# EAGLE design v1.0 (EAGLE 5.11)
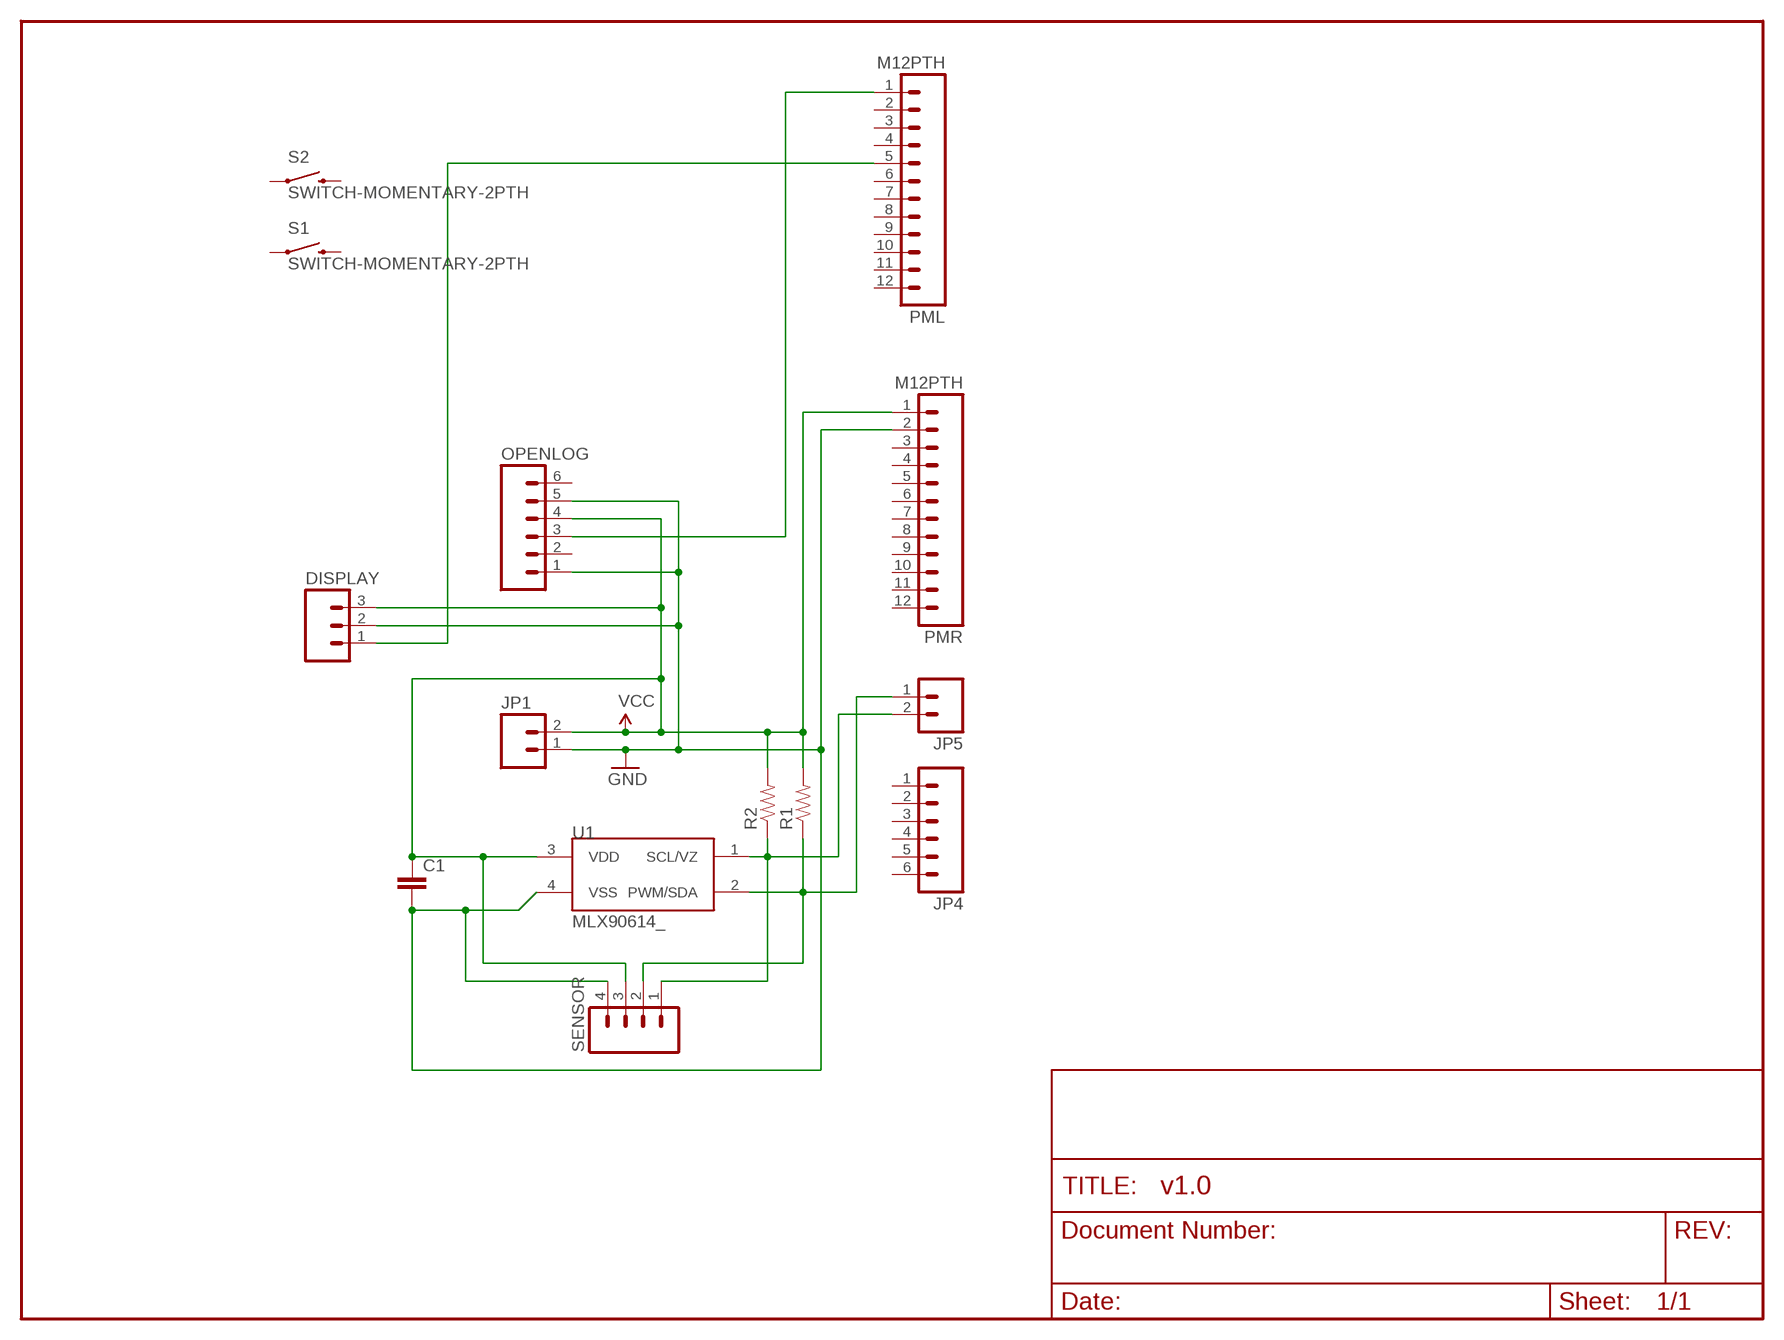
[diagram p0: schematic, sheet 1]

## Parts
C1  CAPPTH3  [CAP-PTH-LARGE]
DISPLAY  M03SCREW_LOCK  [SCREWTERMINAL-3.5MM-3_LOCK.007S]
JP1  M02JST-PTH-2  [JST-2-PTH]
JP4  M06SIP  [1X06]
JP5  M02PTH  [1X02]
OPENLOG  M06LOCK  [1X06_LOCK]
PML  M12PTH  [1X12]
PMR  M12PTH  [1X12]
R1  RESISTORPTH-1/4W  [AXIAL-0.4]
R2  RESISTORPTH-1/4W  [AXIAL-0.4]
S1  SWITCH-MOMENTARY-2PTH  [TACTILE-PTH]
S2  SWITCH-MOMENTARY-2PTH  [TACTILE-PTH]
SENSOR  M04SCREW_LOCK  [SCREWTERMINAL-3.5MM-4_LOCK]
U1  MLX90614_  [TO-39]

## Nets
GND: C1.2 DISPLAY.2 JP1.1 OPENLOG.1 OPENLOG.5 PMR.2 SENSOR.4 U1.4(VSS)
N$1: JP5.2 R2.P$1 SENSOR.1 U1.1(SCL/VZ)
N$2: JP5.1 R1.P$1 SENSOR.2 U1.2(PWM/SDA)
N$4: DISPLAY.1 PML.5
N$6: OPENLOG.3 PML.1
VCC: C1.1 DISPLAY.3 JP1.2 OPENLOG.4 PMR.1 R1.P$2 R2.P$2 SENSOR.3 U1.3(VDD)
Unconnected: JP4.1 JP4.2 JP4.3 JP4.4 JP4.5 JP4.6 OPENLOG.2 OPENLOG.6 PML.2 PML.3 PML.4 PML.6 PML.7 PML.8 PML.9 PML.10 PML.11 PML.12 PMR.3 PMR.4 PMR.5 PMR.6 PMR.7 PMR.8 PMR.9 PMR.10 PMR.11 PMR.12 S1.1 S1.3 S2.1 S2.3

## Library data of the parts
C1 = SparkFun:CAP: Capacitor Standard 0603 ceramic capacitor, and 0.1" leaded capacitor.
DISPLAY = SparkFun:M03: Header 3 Standard 3-pin 0.1" header. Use with straight break away headers (SKU : PRT-00116), right angle break away headers (PRT-00553), swiss pins (PRT-00743), machine pins (PRT-00117), and female headers (PRT-00115). Molex polarized connector foot print use with SKU : PRT-08232 with associated crimp pins and housings.
JP1 JP5 = SparkFun:M02: Header 2 Standard 2-pin 0.1" header. Use with straight break away headers (SKU : PRT-00116), right angle break away headers (PRT-00553), swiss pins (PRT-00743), machine pins (PRT-00117), and female headers (PRT-00115). Molex polarized connector foot print use with SKU : PRT-08233 with associated crimp pins and housings.
JP4 OPENLOG = SparkFun:M06: Header 6 Standard 6-pin 0.1" header. Use with straight break away headers (SKU : PRT-00116), right angle break away headers (PRT-00553), swiss pins (PRT-00743), machine pins (PRT-00117), and female headers (PRT-00115). Molex polarized connector foot print use with SKU : PRT-08094 with associated crimp pins and housings. NOTES ON THE VARIANTS LOCK and LOCK_LONGPADS... This footprint was designed to help hold the alignment of a through-hole component (i.e. 6-pin header) while soldering it into place. You may notice that each hole has been shifted either up or down by 0.005 of an inch from it's more standard position (which is a perfectly straight line). This slight alteration caused the pins (the squares in the middle) to touch the edges of the holes. Because they are alternating, it causes a "brace" to hold the component in place. 0.005 has proven to be the perfect amount of "off-center" position when using our standard breakaway headers. Although looks a little odd when you look at the bare footprint, once you have a header in there, the alteration is very hard to notice. Also, if you push a header all the way into place, it is covered up entirely on the bottom side. This idea of altering the position of holes to aid alignment will be further integrated into the Sparkfun Library for other footprints. It can help hold any component with 3 or more connection pins.
PML PMR = SparkFun:M12: Header 12 Standard 12-pin 0.1" header. Use with straight break away headers (SKU : PRT-00116), right angle break away headers (PRT-00553), swiss pins (PRT-00743), machine pins (PRT-00117), and female headers (PRT-00115).
R1 R2 = SparkFun:RESISTOR: Resistor Basic schematic elements and footprints for 0603, 1206, and PTH resistors.
S1 S2 = SparkFun:SWITCH-MOMENTARY-2
SENSOR = SparkFun:M04: Header 4 Standard 4-pin 0.1" header. Use with straight break away headers (SKU : PRT-00116), right angle break away headers (PRT-00553), swiss pins (PRT-00743), machine pins (PRT-00117), and female headers (PRT-00115). Molex polarized connector foot print use with SKU : PRT-08231 with associated crimp pins and housings. 1MM SMD Version SKU: PRT-10208
U1 = SparkFun:MLX90614: Melexis IR Thermometer

## Board
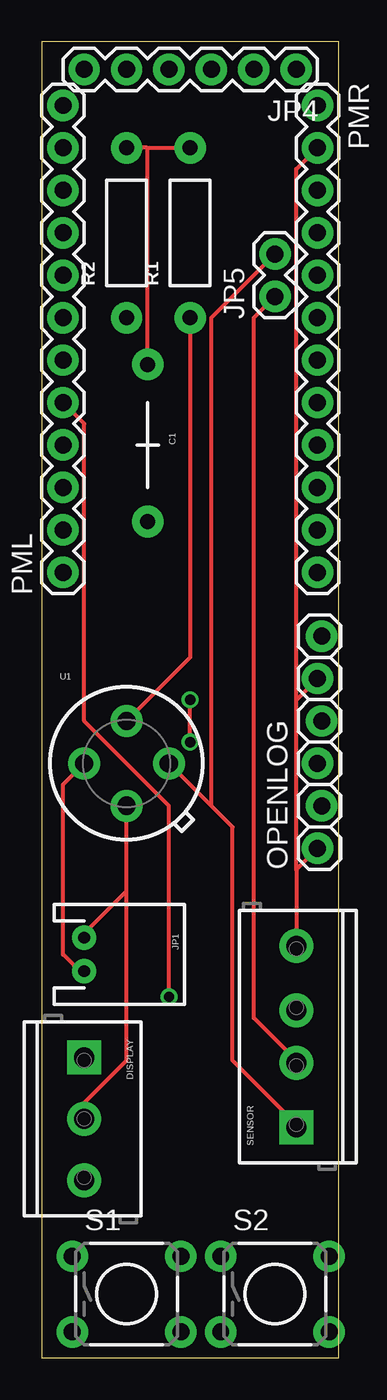
[diagram p1: board, top side]
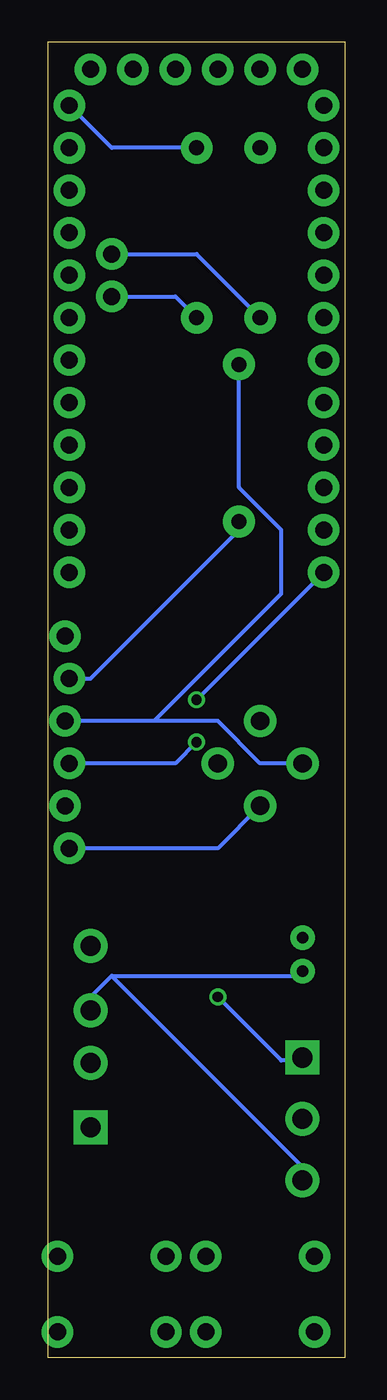
[diagram p2: board, bottom side, seen from below]

Size 17.78 x 78.74 mm. Coordinates in mm from the lower left corner, seen from the top.
Outline: 0,0 17.78,0 17.78,78.74 0,78.74 0,0
Copper layers (1*16): Top 0.035mm / dielectric 1.5mm / Bottom 0.035mm
Design rules "default": minimum track width 10mil, minimum drill 24mil, track to track 8mil, track to pad 8mil, pad to pad 8mil, via to via 8mil, smd to smd 8mil, copper to edge 40mil, drill to drill 8mil, minimum pad ring 10mil, minimum via ring 8mil, stop-mask expansion 4mil, vias tented up to drill 0mil, thermal gap 10mil

### Footprints (pad centres in the part's own frame; a part is rotated, then mirrored left to right if it is on the bottom)
CAP-PTH-LARGE = drill 0.9 pad 1.905 round: 1 -4.826,0; 2 4.572,0
SCREWTERMINAL-3.5MM-3_LOCK.007S = drill 1.2 pad 2.032 square: 1 -0.178,0 | drill 1.2 pad 2.032 round: 2 3.5,0; 3 7.178,0
JST-2-PTH = drill 0.7 pad 1.448 round: 1 -1,0; 2 1,0
1X06 = drill 1.016 pad 1.88 round: 1 0,0; 2 2.54,0; 3 5.08,0; 4 7.62,0; 5 10.16,0; 6 12.7,0
1X02 = drill 1.016 pad 1.88 round: 1 0,0; 2 2.54,0
1X06_LOCK = drill 1.016 pad 1.88 round: 1 0,0; 2 2.54,-0.254; 3 5.08,0; 4 7.62,-0.254; 5 10.16,0; 6 12.7,-0.254
1X12 = drill 1.016 pad 1.88 round: 1 0,0; 2 2.54,0; 3 5.08,0; 4 7.62,0; 5 10.16,0; 6 12.7,0; 7 15.24,0; 8 17.78,0; 9 20.32,0; 10 22.86,0; 11 25.4,0; 12 27.94,0
AXIAL-0.4 = drill 0.9 pad 1.88 round: P$1 -5.08,0; P$2 5.08,0
TACTILE-PTH = drill 1.016 pad 1.88 round: 1 -3.251,2.261; 2 3.251,2.261; 3 -3.251,-2.261; 4 3.251,-2.261
SCREWTERMINAL-3.5MM-4_LOCK = drill 1.2 pad 2.032 square: 1 -0.178,0 | drill 1.2 pad 2.032 round: 2 3.678,0; 3 6.822,0; 4 10.678,0
TO-39 = drill 1.1 pad 1.93 round: 1 2.54,0; 2 0,2.54; 3 -2.54,0; 4 0,-2.54

### Placement (x,y rotation side)
C1  6.35,54.61 270 top
DISPLAY  2.54,17.78 270 top
JP1  2.54,24.13 270 top
JP4  15.24,77.09 180 top
JP5  13.97,63.5 90 top
OPENLOG  16.51,30.48 90 top
PML  1.27,46.99 90 top
PMR  16.51,74.93 270 top
R1  8.89,67.31 90 top
R2  5.08,67.31 90 top
S1  5.08,3.81 0 top
S2  13.97,3.81 0 top
SENSOR  15.24,13.97 90 top
U1  5.08,35.56 0 top

### Tracks (layer width: path | path; a pad name or v marks a point on that pad's centre or on a via)
GND
  Top 0.254: 5.08,27.94 2.54,25.4 JP1.1 | 5.08,27.94 U1.4 | 5.08,27.94 5.08,17.78 2.54,15.24 DISPLAY.2 | OPENLOG.1 15.24,29.21 | 15.24,29.21 SENSOR.4 | 15.24,39.37 OPENLOG.5 | 15.24,29.21 15.24,39.37 | PMR.2 15.24,71.12 15.24,39.37
  Bottom 0.254: OPENLOG.5 15.24,40.64 6.35,49.53 C1.2 | U1.4 7.62,30.48 OPENLOG.1
N$1
  Top 0.254: 10.16,33.02 11.43,31.75 11.43,17.78 15.24,13.97 SENSOR.1 | 10.16,33.02 U1.1 | JP5.2 10.16,62.23 10.16,33.02
  Bottom 0.254: R2.P$1 8.89,66.04 JP5.2
N$2
  Top 0.254: U1.2 8.89,41.91 R1.P$1 | JP5.1 12.7,62.23 12.7,20.32 15.24,17.78 SENSOR.2
  Bottom 0.254: R1.P$1 10.16,63.5 JP5.1
N$4  (via drill 0.61)
  Top 0.254: PML.5 2.54,55.88 2.54,38.1 7.62,33.02 v7.62,21.59
  Bottom 0.254: v7.62,21.59 3.81,17.78 2.54,17.78 DISPLAY.1
N$6  (via drill 0.61)
  Top 0.254: v8.89,36.83 v8.89,39.37
  Bottom 0.254: v8.89,39.37 PML.1 | v8.89,36.83 10.16,35.56 OPENLOG.3
VCC
  Top 0.254: 6.35,72.39 R1.P$2 | 6.35,72.39 R2.P$2 | C1.1 6.35,72.39 | U1.3 1.27,34.29 1.27,24.13 2.54,22.86 JP1.2
  Bottom 0.254: PMR.1 13.97,72.39 R1.P$2 | 11.43,38.1 7.62,38.1 5.08,35.56 U1.3 | 11.43,38.1 OPENLOG.4 | 13.97,22.86 2.54,22.86 JP1.2 | 13.97,22.86 15.24,21.59 SENSOR.3 | 13.97,22.86 2.54,11.43 DISPLAY.3 | 11.43,38.1 3.81,45.72 3.81,49.53 6.35,52.07 C1.1 6.35,59.69